# EAGLE design second_Platine_Power (EAGLE 9.5.2)
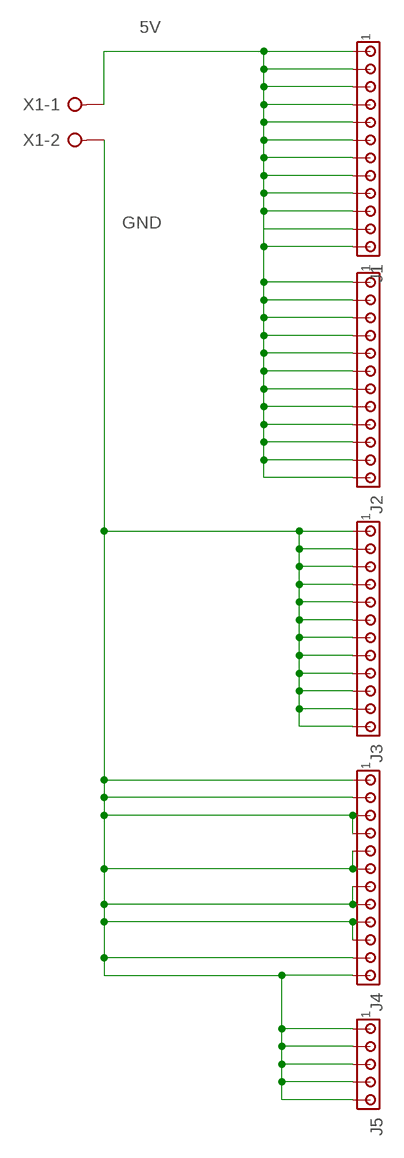
[diagram p0: schematic, sheet 1]

## Parts
J1  MTA12-156  [1X12MTA]
J2  MTA12-156  [1X12MTA]
J3  MTA12-156  [1X12MTA]
J4  MTA12-156  [1X12MTA]
J5  MTA05-156  [1X5MTA]
X1  W237-02P  [W237-132]

## Nets
5V: J1.1 J1.2 J1.3 J1.4 J1.5 J1.6 J1.7 J1.8 J1.9 J1.10 J1.11 J1.12 J2.1 J2.2 J2.3 J2.4 J2.5 J2.6 J2.7 J2.8 J2.9 J2.10 J2.11 J2.12 X1.1
GND: J3.1 J3.2 J3.3 J3.4 J3.5 J3.6 J3.7 J3.8 J3.9 J3.10 J3.11 J3.12 J4.1 J4.2 J4.3 J4.4 J4.5 J4.6 J4.7 J4.8 J4.9 J4.10 J4.11 J4.12 J5.1 J5.2 J5.3 J5.4 J5.5 X1.2

## Library data of the parts
J1-J4 = con-amp:MTA12-156: AMP connector
J5 = con-amp:MTA05-156: AMP connector
X1 = con-wago-508:W237-02P: WAGO SREW CLAMP; OC_FARNELL: unknown; OC_NEWARK: unknown

## Board
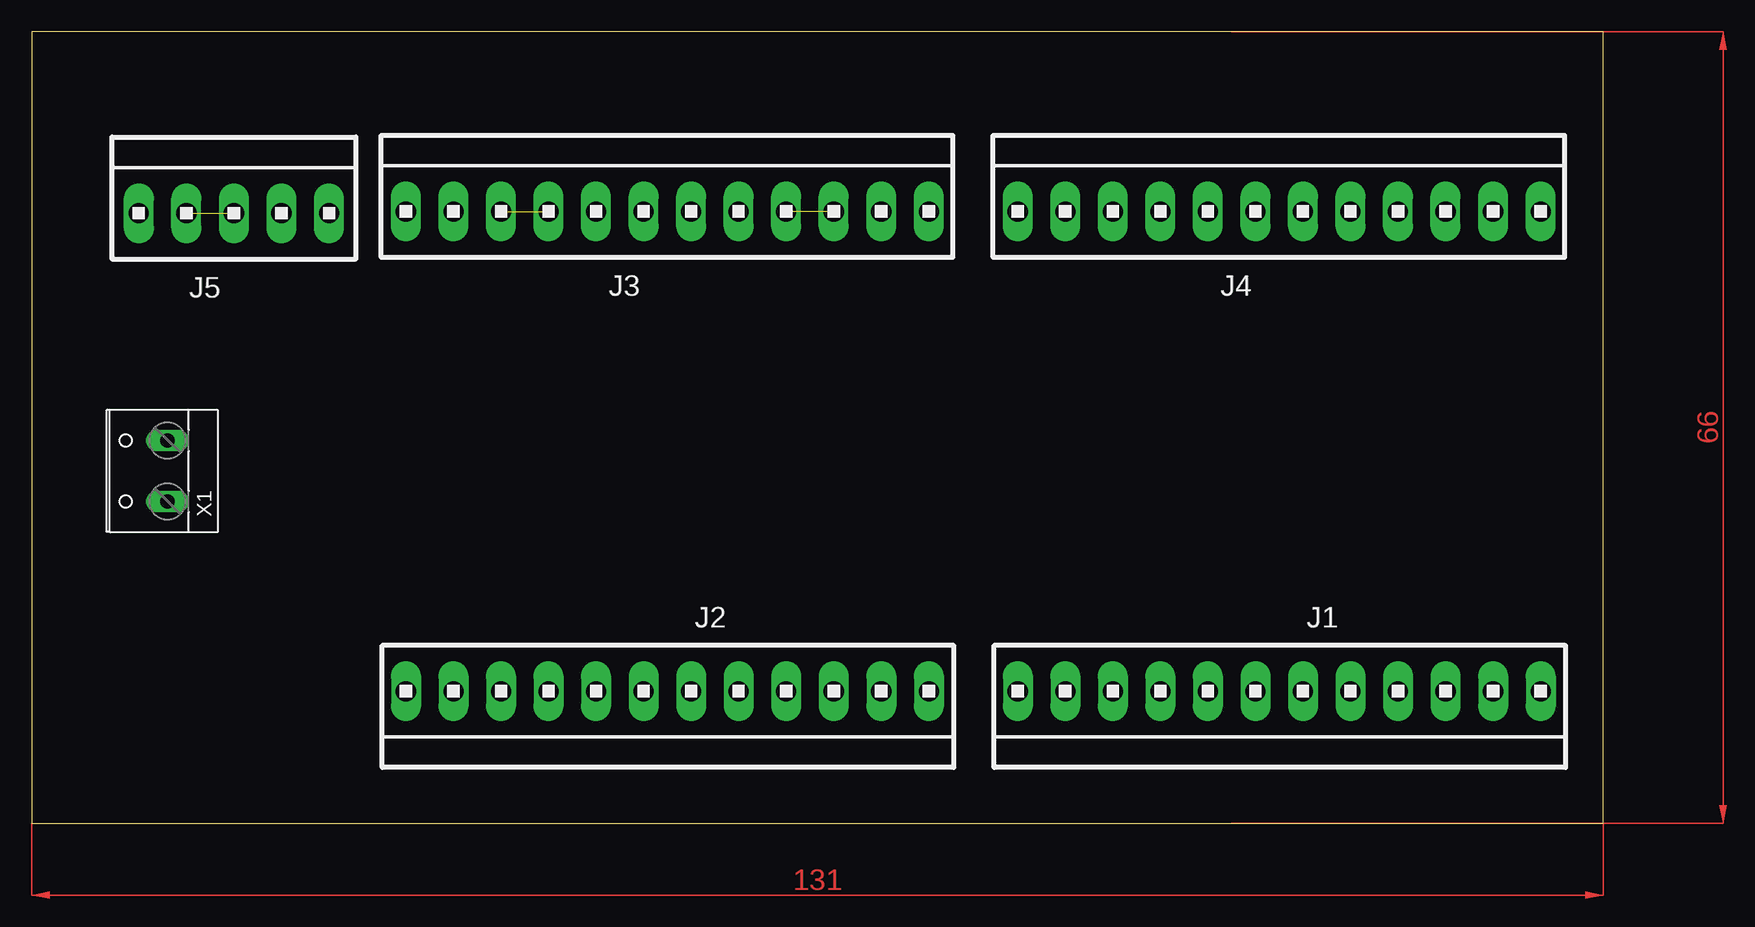
[diagram p1: board, top side]
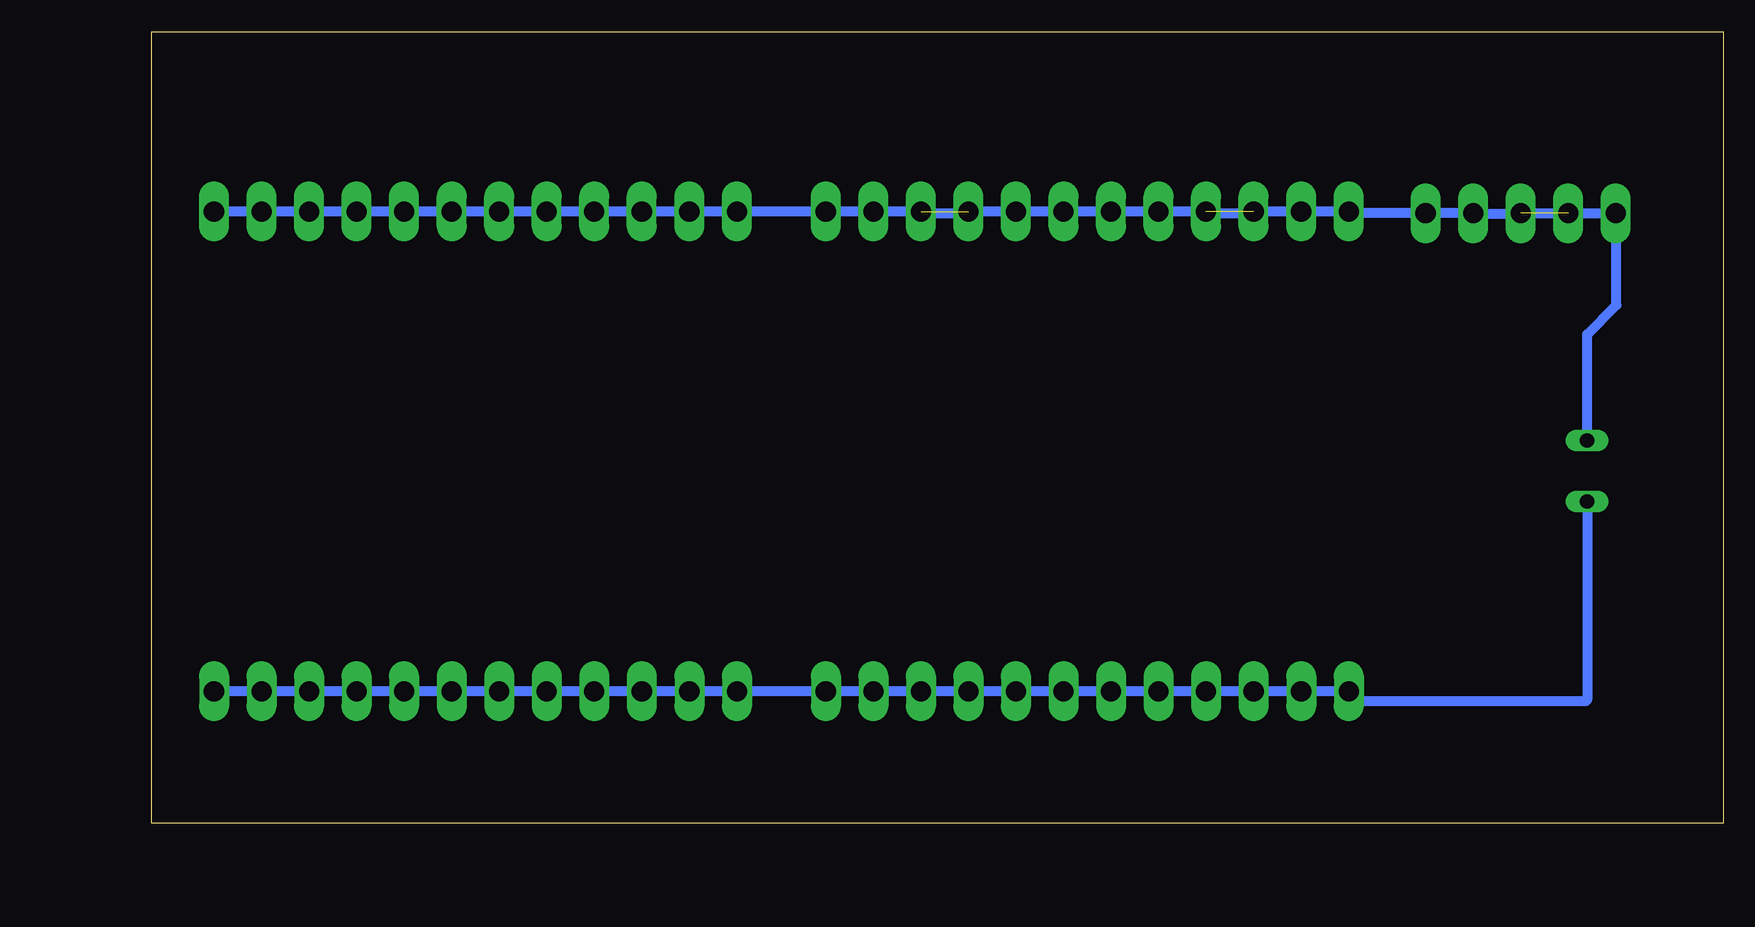
[diagram p2: board, bottom side, seen from below]

Size 131 x 66 mm. Coordinates in mm from the lower left corner, seen from the top.
Outline: 0,0 131,0 131,66 0,66 0,0
Copper layers (1*16): Top 0.035mm / dielectric 1.5mm / Bottom 0.035mm
Design rules "default": minimum track width 6mil, minimum drill 0.35mm, track to track 6mil, track to pad 6mil, pad to pad 6mil, via to via 6mil, smd to smd 6mil, copper to edge 40mil, drill to drill 6mil, minimum pad ring 10mil, minimum via ring 8mil, stop-mask expansion 4mil, vias tented up to drill 0mil, thermal gap 10mil

### Footprints (pad centres in the part's own frame; a part is rotated, then mirrored left to right if it is on the bottom)
1X12MTA = drill 1.676 long: 1 21.793,0; 2 17.831,0; 3 13.868,0; 4 9.906,0; 5 5.944,0; 6 1.981,0; 7 -1.981,0; 8 -5.944,0; 9 -9.906,0; 10 -13.868,0; 11 -17.831,0; 12 -21.793,0
1X5MTA = drill 1.676 long: 1 7.925,0; 2 3.962,0; 3 0,0; 4 -3.962,0; 5 -7.925,0
W237-132 = drill 1.194 long: 1 -2.54,-0.635; 2 2.54,-0.635

### Placement (x,y rotation side)
J1  104,11 180 top
J2  53,11 180 top
J3  53,51 0 top
J4  104,51 0 top
J5  16.87,50.85 0 top
X1  10.69,29.36 90 top

### Tracks (layer width: path | path; a pad name or v marks a point on that pad's centre or on a via)
5V
  Bottom 0.813: X1.1 11.32,10.27 11.43,10.16 30.37,10.16 J2.1 J2.2 J2.3 J2.4 J2.5 J2.6 J2.7 J2.8 J2.9 J2.10 J2.11 J2.12 J1.1 J1.2 J1.3 J1.4 J1.5 J1.6 J1.7 J1.8 J1.9 J1.10 J1.11 J1.12
GND  (3 unrouted)
  Bottom 0.813: X1.2 11.32,40.74 8.89,43.18 8.89,50.8 16.82,50.8 | 16.82,50.8 J5.3 | 16.82,50.8 20.78,50.8 J5.2 J5.1 31.06,50.85 J3.12 J3.11 39.17,51 39.37,50.8 42.89,50.8 J3.9 J3.8 J3.7 J3.6 J3.5 63.3,51 63.5,50.8 66.67,50.8 J3.3 J3.2 J3.1 J4.12 J4.11 J4.10 J4.9 J4.8 J4.7 J4.6 | J5.4 J5.5 | J4.6 106.48,51 106.68,50.8 106.18,50.8 J4.6 | J4.6 J4.5 | J4.5 110.29,51 110.49,50.8 110.14,50.8 J4.5 | J4.5 J4.4 J4.3 J4.2 J4.1
(copper drawn outside any net)
  shapes: Top area x2